# Altium schematic sheet 2_PowerRails.SchDoc: Power Conversion + Rails
size C; Author: Praveen Perera; DrawnBy: Praveen Perera; Engineer: Praveen Perera; Revision: 1; SheetNumber: 2; SheetTotal: 9; Time: 12/22/2025
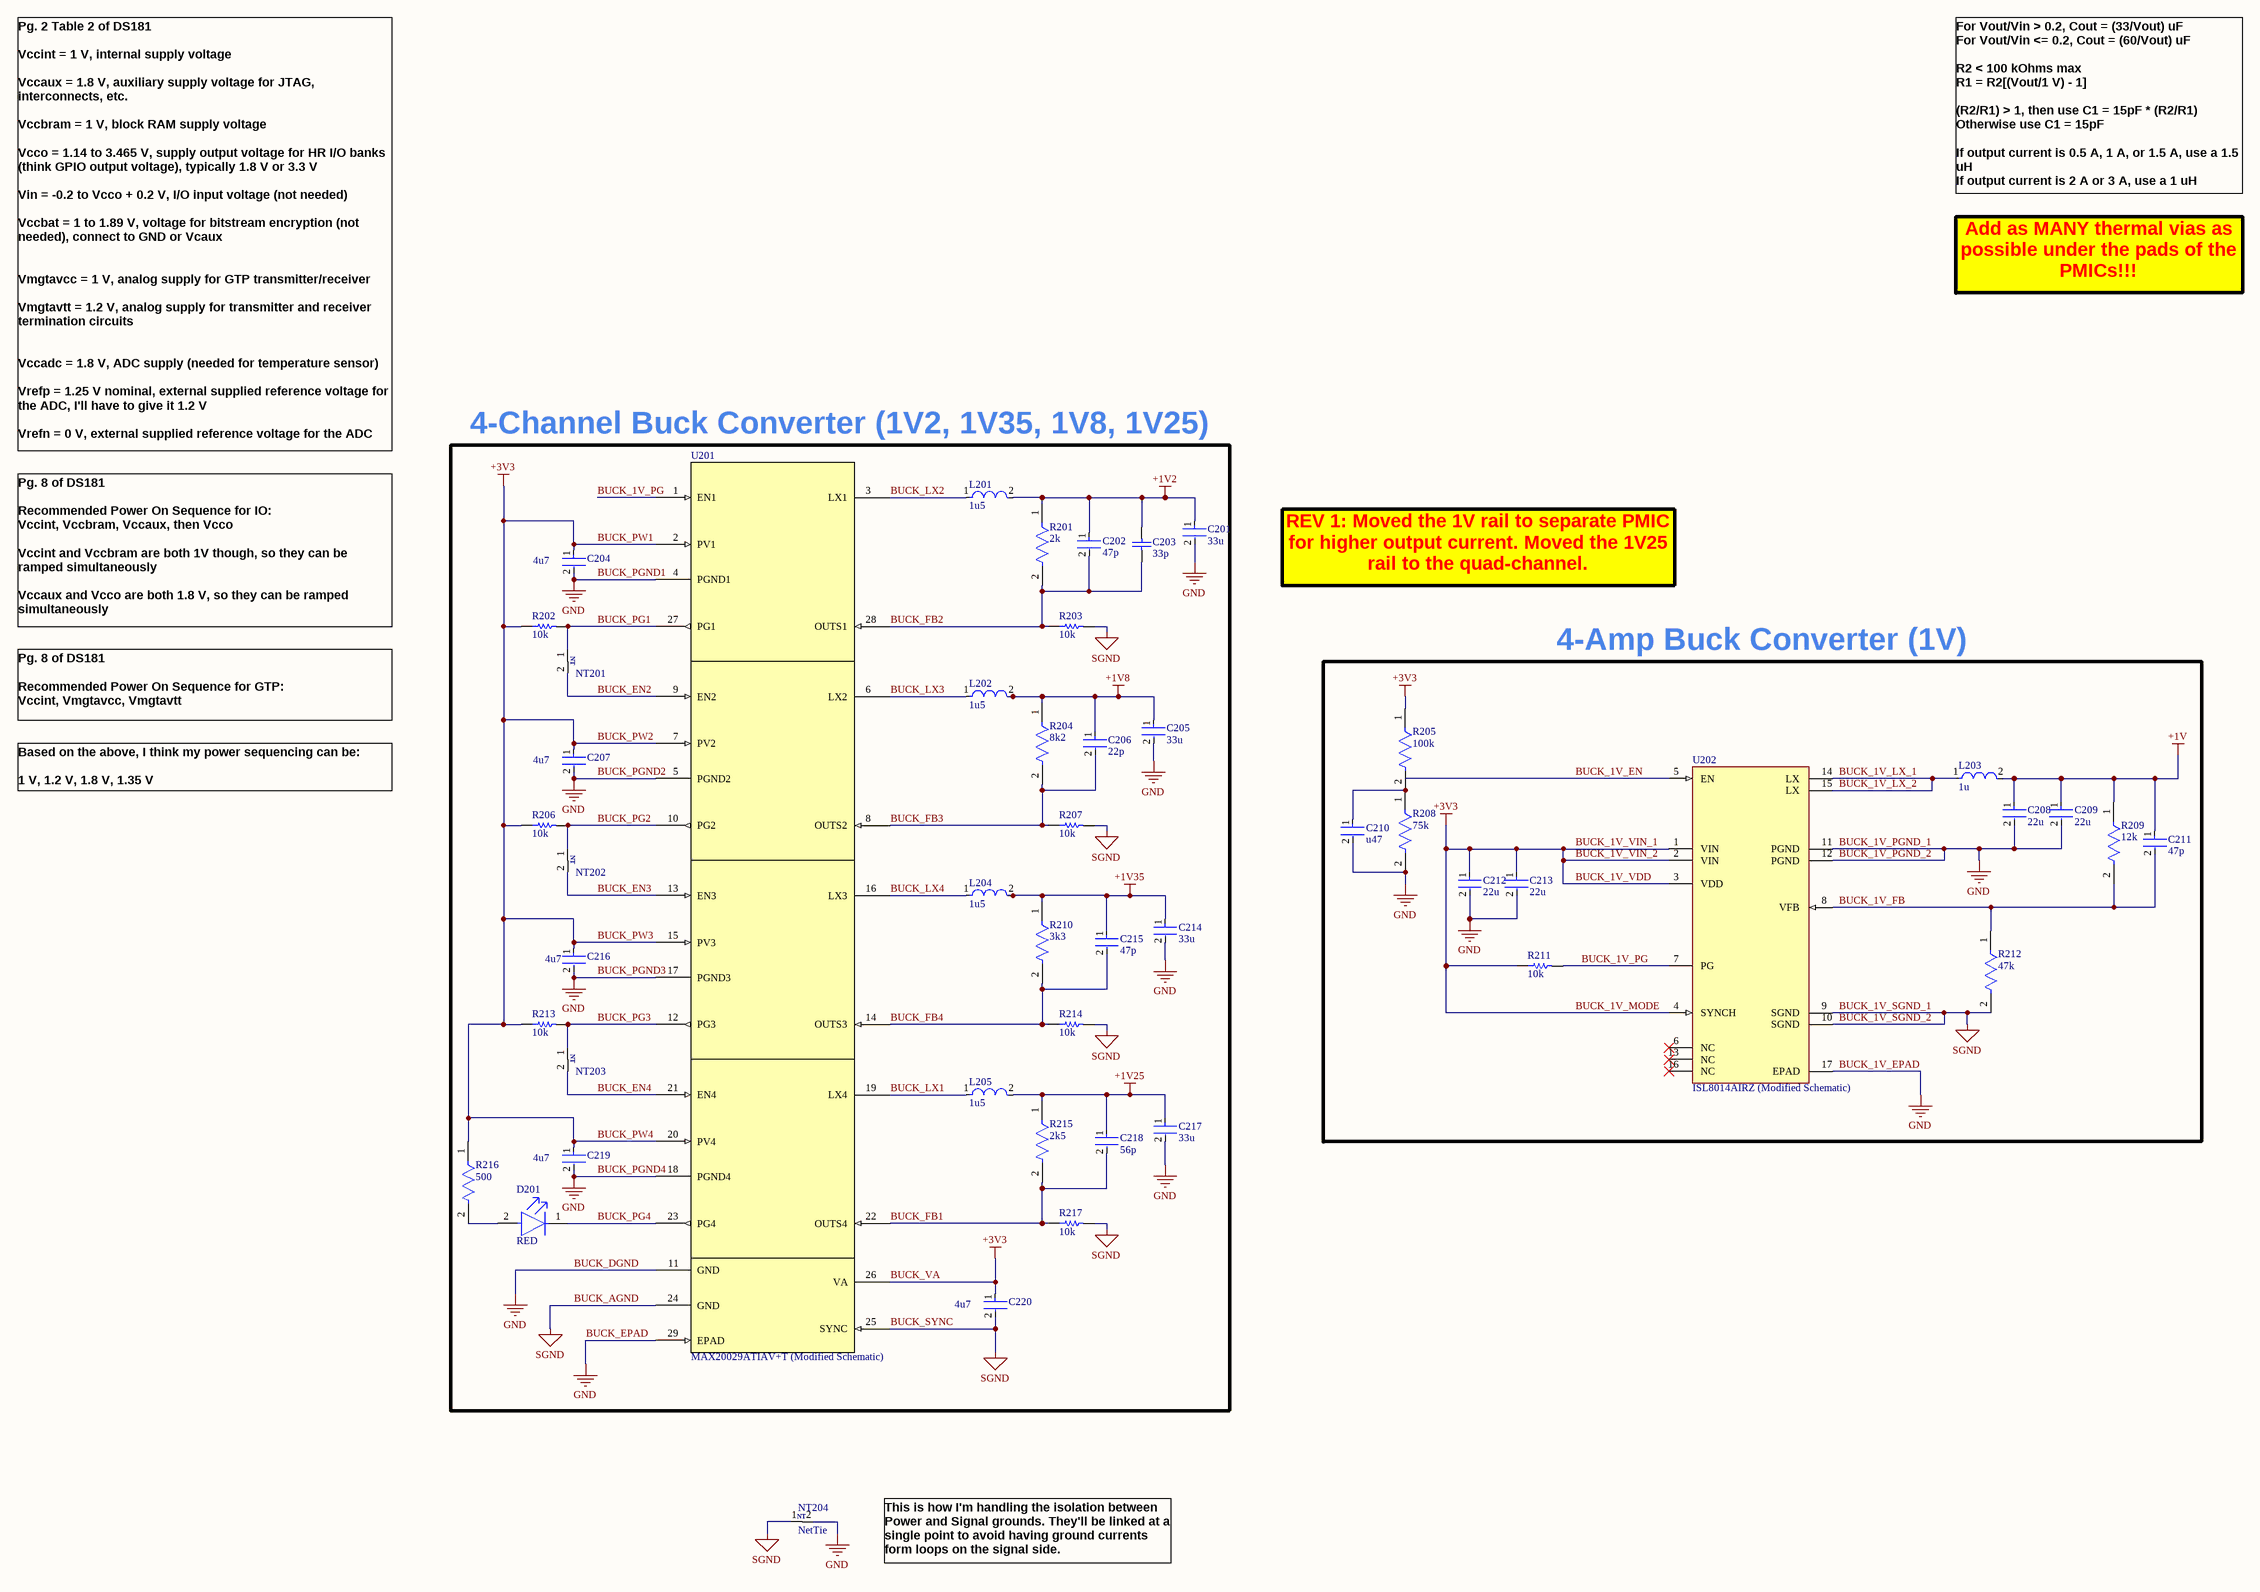
[diagram p0: 2_PowerRails.SchDoc]

## Parts
C201  33u  [FP-C2012-125-0_2-IPC_A]
C202  47p  [FP-GCQ155-0_05-MFG]
C203  33p  [CAPC1005X60X26NL10T16]
C204  4u7  [FP-GCM31C-0_2-e0_3_0_8-IPC_C]
C205  33u  [FP-C2012-125-0_2-IPC_A]
C206  22p  [FP-GJM155-0_05-IPC_A]
C207  4u7  [FP-GCM31C-0_2-e0_3_0_8-IPC_C]
C208  22u  [FP-GRM188-0_2-IPC_A]
C209  22u  [FP-GRM188-0_2-IPC_A]
C210  u47  [FP-C0603-030-0_03-IPC_A]
C211  47p  [FP-GCQ155-0_05-MFG]
C212  22u  [FP-GRM188-0_2-IPC_A]
C213  22u  [FP-GRM188-0_2-IPC_A]
C214  33u  [FP-C2012-125-0_2-IPC_A]
C215  47p  [FP-GCQ155-0_05-MFG]
C216  4u7  [FP-GCM31C-0_2-e0_3_0_8-IPC_C]
C217  33u  [FP-C2012-125-0_2-IPC_A]
C218  56p  [FP-C0402-BB-MFG]
C219  4u7  [FP-GCM31C-0_2-e0_3_0_8-IPC_C]
C220  4u7  [FP-GCM31C-0_2-e0_3_0_8-IPC_C]
D201  RED  [FP-SML-LX0603SIW-TR-MFG]
L201  1u5  [FP-IHLP-2525CZ-FP_2_413x3-MFG]
L202  1u5  [FP-IHLP-2525CZ-FP_2_413x3-MFG]
L203  1u  [FP-IHLP-2525CZ-FP_2_413x3-MFG]
L204  1u5  [FP-IHLP-2525CZ-FP_2_413x3-MFG]
L205  1u5  [FP-IHLP-2525CZ-FP_2_413x3-MFG]
NT201  NetTie  [NETTIE]  (value not drawn)  (net tie, no BOM)
NT202  NetTie  [NETTIE]  (value not drawn)  (net tie, no BOM)
NT203  NetTie  [NETTIE]  (value not drawn)  (net tie, no BOM)
NT204  NetTie  [NETTIE]  (net tie, no BOM)
R201  2k  [FP-MCS0402-IPC_A]
R202  10k  [RESC1005X40X25LL10T10]
R203  10k  [RESC1005X40X25LL10T10]
R204  8k2  [FP-ERA2A-MFG]
R205  100k  [FP-MCS0402-MFG]
R206  10k  [RESC1005X40X25LL10T10]
R207  10k  [RESC1005X40X25LL10T10]
R208  75k  [FP-CR0402-IPC_C]
R209  12k  [FP-RT0402-MFG]
R210  3k3  [FP-ERA2A-MFG]
R211  10k  [RESC1005X40X25LL10T10]
R212  47k  [FP-ERA2A-MFG]
R213  10k  [RESC1005X40X25LL10T10]
R214  10k  [RESC1005X40X25LL10T10]
R215  2k5  [FP-MCT0603-MFG]
R216  500  [FP-PNM0402-MFG]
R217  10k  [RESC1005X40X25LL10T10]
U201  MAX20029ATIAV+T (Modified Schematic)  [21-0140L_T2855-5_MXM]
U202  ISL8014AIRZ (Modified Schematic)  [QFN65P400X400X100-17_L16_4x4_M]

## Nets
+1V: C208.1 C209.1 C211.1 L203.2 R209.1
+1V2: C201.1 C202.1 C203.2 L201.2 R201.1
+1V8: C205.1 C206.1 L202.2 R204.1
+1V25: C217.1 C218.1 L205.2 R215.1
+1V35: C214.1 C215.1 L204.2 R210.1
BUCK_1V_EPAD: C201.2 C204.2 C205.2 C207.2 C208.2 C209.2 C210.2 C212.2 C213.2 C214.2 C216.2 C217.2 C219.2 NT204.2 R208.2 U201.4(PGND1) U201.5(PGND2) U201.11(GND) U201.17(PGND3) U201.18(PGND4) U201.29(EPAD) U202.11(PGND) U202.12(PGND) U202.17(EPAD)  [also labelled BUCK_1V_PGND_1, BUCK_1V_PGND_2, BUCK_DGND, BUCK_EPAD, BUCK_PGND1, BUCK_PGND2, BUCK_PGND3, BUCK_PGND4, GND]
BUCK_1V_MODE: C204.1 C207.1 C212.1 C213.1 C216.1 C219.1 C220.1 R202.1 R205.1 R206.1 R211.1 R213.1 R216.1 U201.2(PV1) U201.7(PV2) U201.15(PV3) U201.20(PV4) U201.26(VA) U202.1(VIN) U202.2(VIN) U202.3(VDD) U202.4(SYNCH)  [also labelled +3V3, BUCK_1V_VDD, BUCK_1V_VIN_1, BUCK_1V_VIN_2, BUCK_PW1, BUCK_PW2, BUCK_PW3, BUCK_PW4, BUCK_VA]
BUCK_1V_SGND_1: C220.2 NT204.1 R203.2 R207.2 R212.2 R214.2 R217.2 U201.24(GND) U201.25(SYNC) U202.9(SGND) U202.10(SGND)  [also labelled BUCK_1V_SGND_2, BUCK_AGND, BUCK_SYNC, SGND]
BUCK_1V_EN: U202.5(EN)
BUCK_1V_FB: C211.2 R209.2 R212.1 U202.8(VFB)
BUCK_1V_LX_1: L203.1 U202.14(LX) U202.15(LX)  [also labelled BUCK_1V_LX_2]
BUCK_1V_PG: R211.2 U201.1(EN1) U202.7(PG)
BUCK_EN2: NT201.2 U201.9(EN2)
BUCK_EN3: NT202.2 U201.13(EN3)
BUCK_EN4: NT203.2 U201.21(EN4)
BUCK_FB1: C218.2 R215.2 R217.1 U201.22(OUTS4)
BUCK_FB2: C202.2 C203.1 R201.2 R203.1 U201.28(OUTS1)
BUCK_FB3: C206.2 R204.2 R207.1 U201.8(OUTS2)
BUCK_FB4: C215.2 R210.2 R214.1 U201.14(OUTS3)
BUCK_LX1: L205.1 U201.19(LX4)
BUCK_LX2: L201.1 U201.3(LX1)
BUCK_LX3: L202.1 U201.6(LX2)
BUCK_LX4: L204.1 U201.16(LX3)
BUCK_PG1: NT201.1 R202.2 U201.27(PG1)
BUCK_PG2: NT202.1 R206.2 U201.10(PG2)
BUCK_PG3: NT203.1 R213.2 U201.12(PG3)
BUCK_PG4: D201.1(C) U201.23(PG4)
NetC210_1: C210.1 R205.2 R208.1
NetD201_2: D201.2(A) R216.2

Not connected (* = marked no-connect by the designer): U202 6(NC)* 13(NC)* 16(NC)*

## Notes on the sheet
- For Vout/Vin > 0.2, Cout = (33/Vout) uF
  For Vout/Vin <= 0.2, Cout = (60/Vout) uF
  R2 < 100 kOhms max
  R1 = R2[(Vout/1 V) - 1]
  (R2/R1) > 1, then use C1 = 15pF * (R2/R1)
  Otherwise use C1 = 15pF
  If output current is 0.5 A, 1 A, or 1.5 A, use a 1.5 uH
  If output current is 2 A or 3 A, use a 1 uH
  If output voltage is less than 0.9 V, use a 0.47 uH
- Add as MANY thermal vias as possible under the pads of the PMICs!!!
- Pg. 2 Table 2 of DS181
  Vccint = 1 V, internal supply voltage
  Vccaux = 1.8 V, auxiliary supply voltage for JTAG, interconnects, etc.
  Vccbram = 1 V, block RAM supply voltage
  Vcco = 1.14 to 3.465 V, supply output voltage for HR I/O banks (think GPIO output voltage), typically 1.8 V or 3.3 V
  Vin = -0.2 to Vcco + 0.2 V, I/O input voltage (not needed)
  Vccbat = 1 to 1.89 V, voltage for bitstream encryption (not needed), connect to GND or Vcaux
  Vmgtavcc = 1 V, analog supply for GTP transmitter/receiver
  Vmgtavtt = 1.2 V, analog supply for transmitter and receiver termination circuits
  Vccadc = 1.8 V, ADC supply (needed for temperature sensor)
  Vrefp = 1.25 V nominal, external supplied reference voltage for the ADC, I'll have to give it 1.2 V
  Vrefn = 0 V, external supplied reference voltage for the ADC
- 4-Channel Buck Converter (1V2, 1V35, 1V8, 1V25)
- Pg. 8 of DS181
  Recommended Power On Sequence for IO:
  Vccint, Vccbram, Vccaux, then Vcco
  Vccint and Vccbram are both 1V though, so they can be ramped simultaneously
  Vccaux and Vcco are both 1.8 V, so they can be ramped simultaneously
- REV 1: Moved the 1V rail to separate PMIC for higher output current. Moved the 1V25 rail to the quad-channel.
- 4-Amp Buck Converter (1V)
- Pg. 8 of DS181
  Recommended Power On Sequence for GTP:
  Vccint, Vmgtavcc, Vmgtavtt
- Based on the above, I think my power sequencing can be:
  1 V, 1.2 V, 1.8 V, 1.35 V
- This is how I'm handling the isolation between Power and Signal grounds. They'll be linked at a single point to avoid having ground currents form loops on the signal side.
- (in symbol CMP-047-000007-1) NT

## Library data of the parts
C201 C205 C214 C217 = CMP-08246-002720-1: C2012X5R1A336M125AC / Multilayer Ceramic Capacitors 33μF ±20% 10V X5R SMD 0805; Capacitance: 33uF; Dielectric: X5R; Series: C; Packaging: Tape and Reel; Voltage Rating: 10V; Height: 1.25mm; Tolerance: 20%; Thickness: 0.057inch; Min Operating Temperature: -55°C; Max Operating Temperature: 85°C; Case Code (Imperial): 0805; Voltage Rating (DC): 10V; Case Code (Metric): 2012; Length: 2mm; REACH SVHC: No SVHC; Depth: 1.25mm; Package Quantity: 1; Dielectric Material: Ceramic; Lead Free: Lead Free; Case/Package: 0805; Termination: SMD/SMT; Resistor Type: Ceramic; RoHS Compliant: Yes; Width: 0.049inch; Weight: 0.000194oz; Mount: Surface Mount
C202 C211 C215 = CMP-06035-040611-1: GCQ1555C1H470GB01D / High Q Ceramic Capacitor for Automotive 47pF ±2% 50VDC C0G 0402 Paper T/R
C203 = CMP-2008-01050-1: VJ0402A330JXAAC; Manufacturer: Vitramon; Part Number: VJ0402A330JXAAC
C204 C207 C216 C219 C220 = CMP-06035-020722-1: GCM31CR71E475KA55K / Ceramic Capacitor for Automotive 4.7uF ±10% 25VDC X7R 1206 Embossed T/R; Voltage Rating: 25V; Case Code (Imperial): 1206; Depth: 1.6mm; Length: 3.2mm; Ratings: AEC-Q200; Capacitance: 4.7uF; Height: 1.6mm; Case/Package: 1206; Packaging: Tape and Reel; Radiation Hardening: No; Dielectric: X7R; Case Code (Metric): 3216; Termination: SMD/SMT; Package Quantity: 6000; Max Operating Temperature: 125°C; Voltage Rating (DC): 25V; Thickness: 0.071inch; Width: 0.063inch; Min Operating Temperature: -55°C; Mount: Surface Mount; Tolerance: 10%
C206 = CMP-06035-061679-1: GJM1555C1H220GB01D / Multi-Layer Ceramic Capacitor 22pF C0G  ±2% 0402 Paper T/R; Voltage Rating (DC): 50V; Length: 1mm; Thickness: 500um; Tolerance: 2%; Capacitance: 22pF; RoHS Compliant: Yes; Dielectric: C0G; Width: 500um
C208 C209 C212 C213 = CMP-06035-063651-1: GRM188R61C226ME01D / Multilayer Ceramic Capacitor 22uF 20% 16V X5R 0603 Paper T/R
C210 = CMP-08246-006895-1: C0603X5R1A474M030BC / Multilayer Ceramic Capacitors 470nF ±20% 10V X5R SMD 0201; Package Quantity: 1; Mount: Surface Mount; RoHS Compliant: Yes; Case/Package: 0201; Case Code (Metric): 0603; Max Operating Temperature: 85°C; Series: C; Min Operating Temperature: -55°C; Length: 0.024inch; Dielectric Material: Ceramic; REACH SVHC: No SVHC; Lead Free: Lead Free; Case Code (Imperial): 0201; Width: 0.012inch; Dielectric: X5R; Capacitance: 470nF; Tolerance: 20%; Thickness: 0.013inch; Voltage Rating: 10V; Packaging: Cut Tape; Voltage Rating (DC): 10V
C218 = CMP-03020-005689-1: C0402C560K5HACTU / C0402 56 pF X8R 10.00% 50 V; Manufacturer: Kemet; Material: Ceramic; Voltage Rating: 50 V; Tolerance: 0.1; Capacitance: 56 pF; Value: 56 pF; Temperature Coefficient: 15%; Device Class L1: Passive Components; Description: C0402 56 pF X8R 10.00% 50 V; Device Class L2: Capacitors; Manufacturer Part Number: C0402C560K5HACTU; Package: C0402-BB; ComponentLink2URL: https://content.kemet.com/datasheets/KEM_C1002_X7R_SMD.pdf; Temperature Range Low: -55°C; Category: Cap; RoHS: TRUE; Height: 0.55mm; Temperature: -55°C to +125°C; Temperature Range High: +125°C; Automotive: No; Octopart: https://octopart.com/c0402c560k5hactu-kemet-88724612; Lead Free: Yes; Device Class L3: Ceramic Capacitors; Ipc Land Pattern Name: CAPC10050X50; ComponentLink2Description: Datasheet; Temperature Characteristic: X8R
D201 = CMP-57192-000009-1: SML-LX0603SIW-TR / LED RED DIFFUSED SMD; Test Current: 20mA; Forward Voltage: 2V; Approvals: UL; Dominant Wavelength: 636nm; Viewing Angle: 140°; Lens Color: White; Luminous Intensity: 60mcd; Power Rating: 50mW; Number of LEDs: 1; Color: Red; Forward Current: 20mA; Moisture Sensitivity Level: 2; Case Code (Imperial): 0603; Lead Free: Lead Free; Lens Transparency: Diffused; Case Code (Metric): 1608; Height: 0.6mm; Max Operating Temperature: 85°C; Width: 0.8mm; Lens Style: Diffused; Illumination Color: Red; Wavelength: 636nm; REACH SVHC: No SVHC; Package Quantity: 1; RoHS Compliant: Yes; Case/Package: 0603; Number of Pins: 2; Packaging: Tape and Reel; Length: 1.6mm; Mount: Surface Mount; Min Operating Temperature: -25°C
L201 L202 L204 L205 = CMP-02424-000713-1: IHLP2525CZER1R5M07 / Commercial Inductors, High Saturation Series, 5 % DCR Tolerance 1.5uH 9A 14.5mΩ 20%; DC Resistance (DCR): 14.5mR; Saturation Current: 18A; Test Frequency: 100kHz; Shielding: Shielded; Lead Free: Lead Free; Tolerance: 20%; Radiation Hardening: No; Series: IHLP-2525CZ-07; Width: 0.255inch; Length: 0.27inch; Depth: 6.72mm; Case/Package: Nonstandard; Height: 3mm; Mount: Surface Mount; Package Quantity: 2000; Current Rating: 9A; Height - Seated (Max): 0.118inch; Packaging: Tape and Reel; Inductance: 1.5uH; Max Operating Temperature: 125°C; Min Operating Temperature: -55°C
L203 = CMP-02424-000664-1: IHLP2525CZER1R0M8A / Automotive Inductors, High Temperature (180 °C) Series 1uH 12A 8.45mΩ 20%; Test Frequency: 100kHz; DC Resistance (DCR): 8.45mR; Self Resonant Frequency: 59.1MHz; Saturation Current: 13A; Shielding: Shielded; Inductance Tolerance: 20%; Width: 6.47mm; Min Operating Temperature: -55°C; Height - Seated (Max): 0.118inch; Ratings: AEC-Q200; Max Operating Temperature: 180°C; RMS Current (Irms): 12A; Package Quantity: 2000; Mount: Surface Mount; Height: 3mm; Termination: SMD/SMT; Case/Package: Nonstandard; Packaging: Tape and Reel; Tolerance: 20%; Current Rating: 12A; Inductance: 1uH; Max DC Current: 12A; Length: 0.27inch
NT201-NT204 = CMP-047-000007-1: Net Tie; Source: Schematic-Lib-PhilsLab.SchLib; Design Item ID: NetTie
R201 = CMP-02407-003721-1: MCS0402MD2001BE100 / RES SMD 1.2K OHM 1% 1/10W 0402; Resistance: 2kR; Temperature Coefficient: 25ppm/°C; Power Rating: 63mW; Voltage Rating: 50V; Tolerance: 0.1%; Lead Free: Lead Free; Max Operating Temperature: 155°C; Case/Package: 0402; Case Code (Metric): 1005; Height: 0.32mm; Composition: Thin Film; Weight: 2.1E-05oz; Width: 0.5mm; Case Code (Imperial): 0402; Packaging: Tape and Reel; Length: 1mm; Min Operating Temperature: -55°C; Contact Plating: Tin
R202 R203 R206 R207 R211 R213 R214 R217 = CMP-2002-04584-1: SG73P1ETTP1002F; Manufacturer: KOA Speer; Part Number: SG73P1ETTP1002F
R204 = CMP-2002-05828-2: ERA-2AEB822X / RES SMD 8.2K OHM 0.1% 1/16W 0402; Manufacturer: Panasonic Electronic Components; Value: 8.2kΩ; Temperature Coefficient: 25ppm/°C; Voltage Rating: 50V; Automotive Grade: Grade 0; Power Rating: 0.063W; Temperature Range Low: -55°C; Lead Free: Yes; Device Class L2: Resistors; Height: 0.4mm; RoHS: TRUE; Mouser Description: Thin Film Resistors - SMD 0402 1/16W 8.2Kohms; Octopart: https://octopart.com/era-2aeb822x-panasonic-43284358; Tolerance: 0.1%; Composition: Thin Film; Package: ERA2A; Resistance: 8.2kΩ; Temperature: -55°C to +155°C; Series: ERA; Manufacturer Part Number: ERA-2AEB822X; ComponentLink2URL: https://industrial.panasonic.com/cdbs/www-data/pdf/RDM0000/AOA0000C307.pdf; Digikey Description: RES SMD 8.2K OHM 0.1% 1/16W 0402; ComponentLink2Description: Datasheet; Category: Res; Footprint Url: https://industrial.panasonic.com/cdbs/www-data/pdf/RDM0000/DMM0000COL17.pdf; Temperature Range High: +155°C; Automotive: Yes; Device Class L1: Passive Components; Device Class L3: Chip SMD Resistors
R205 = CMP-02407-000800-1: MCS04020D1003BE000 / RES SMD 1.2K OHM 1% 1/10W 0402; Temperature Coefficient: 25ppm/°C; Resistance: 100kR; Tolerance: 0.1%; Min Operating Temperature: -55°C; Lead Free: Lead Free; Contact Plating: Tin; Radiation Hardening: No; Max Operating Temperature: 125°C; Composition: Thin Film; Case/Package: 0402
R208 = CMP-2002-05392-2: CR0402-FX-7502GLF / Thick Film Chip Resistors 0402 75kΩ 0.0625W 1% 100ppm/°C; Max Power Dissipation: 63mW; Voltage Rating: 50V; Power Rating: 62.5mW; Resistance: 75kR; Min Operating Temperature: -55°C; Max Operating Temperature: 125°C; Mount: Surface Mount; Radiation Hardening: No; Depth: 0.5mm; Case Code (Imperial): 0402; Length: 1mm; Number of Terminations: 2; Case Code (Metric): 1005; Case/Package: 0402; Package Quantity: 10000; Temperature Coefficient: 100ppm/°C; Contact Plating: Tin; Composition: Thick Film; Thickness: 356um; Termination: SMD/SMT; Tolerance: 1%; Packaging: Tape and Reel; Width: 0.5mm; Height: 0.016inch; Military Standard: Not
R209 = CMP-03412-001954-1: RT0402DRE0712KL / RES SMD 12K OHM 0.5% 1/16W 0402; Manufacturer: Yageo; Power Rating: 0.063W; Description: RT0402 12KΩ 0.063W 50 ppm/°C 0.50%; Tolerance: 0.005; Temperature Coefficient: 50 ppm/°C; Voltage Rating: 50V; Value: 12KΩ; Series: RT; Octopart: https://octopart.com/rt0402dre0712kl-yageo-1393491; Category: Res; Mouser Description: Thin Film Resistors 1/16W 12K ohm .5% 50ppm; Manufacturer Part Number: RT0402DRE0712KL; Device Class L1: Passive Components; Height: 0.35mm; Temperature: -55°C to +155°C; ComponentLink2Description: Datasheet; Temperature Range High: +155°C; Device Class L3: Chip SMD Resistors; Device Class L2: Resistors; Lead Free: Yes; Footprint Url: http://www.yageo.com/exep/pages/download/literatures/PYu-R_Mount_10.pdf; Ipc Land Pattern Name: RESC10050X30; RoHS: TRUE; Package: RT0402; Composition: Thin Film; Digikey Description: RES SMD 12K OHM 0.5% 1/16W 0402; Automotive: No; ComponentLink2URL: http://www.yageo.com/documents/recent/PYu-RT_1-to-0.01_RoHS_L_9.pdf; Temperature Range Low: -55°C; Resistance: 12KΩ
R210 = CMP-2002-05884-2: ERA-2AEB332X; NexarPartId: 9251384; Voltage Rating (DC): 25V; Temperature Coefficient: 25ppm/°C; Tolerance: 0.1%; Resistance: 3.3kΩ; Power Rating: 63mW; Case/Package: 0402; Number of Terminations: 2; Military Standard: Not; Case Code (Imperial): 0402; Length: 1mm; Contact Plating: Tin; Termination: SMD/SMT; Schedule B: 8533210045, 8533210045; Voltage Rating: 25V; Lead Free: Lead Free; Min Operating Temperature: -55°C; REACH SVHC: No SVHC; Max Power Dissipation: 63mW; Weight: 793.786648µg; RoHS: Compliant; Depth: 500µm; Packaging: Cut Tape; Max Operating Temperature: 155°C; Width: 500µm; Case Code (Metric): 1005; Height: 350µm; Composition: Thin Film; Lifecycle Status: Production; Radiation Hardening: No; Number of Pins: 2; Mount: Surface Mount
R212 = CMP-2002-05889-2: ERA-2AEB473X; NexarPartId: 9251373; Voltage Rating: 25V; Tolerance: 0.1%; Resistance: 47kΩ; Power Rating: 63mW; Temperature Coefficient: 25ppm/°C; Radiation Hardening: No; Case Code (Imperial): 0402; Depth: 500µm; Military Standard: Not; Number of Pins: 2; Number of Terminations: 2; Length: 1mm; RoHS: Compliant; Case Code (Metric): 1005; Schedule B: 8533210045, 8533210045; Composition: Thin Film; REACH SVHC: Unknown; Lifecycle Status: Production; Case/Package: 0402; Mount: Surface Mount; Packaging: Tape & Reel; Contact Plating: Tin; Lead Free: Lead Free; Max Power Dissipation: 63mW; Voltage Rating (DC): 25V; Height: 350µm; Width: 508µm; Min Operating Temperature: -55°C; Max Operating Temperature: 155°C
R215 = CMP-02407-001734-1: MCT06030E2501BP100 / RES SMD 100 OHM 1% 1/8W 0603; Tolerance: 0.1%; Resistance: 2.5kR; Temperature Coefficient: 15ppm/°C; Length: 1.55mm; Max Operating Temperature: 125°C; Composition: Thin Film; Radiation Hardening: No; Lead Free: Lead Free; Military Standard: Not; Packaging: Tape and Reel; Depth: 0.85mm; Contact Plating: Tin; Width: 850um; Case/Package: 0603; Min Operating Temperature: -55°C
R216 = CMP-02407-011888-1: PNM0402E5000BST1 / RES SMD 500 OHM 0.1% 1/20W 0402; Temperature Coefficient: 25ppm/°C; Max Power Dissipation: 50mW; Resistance: 500R; Width: 0.022inch; Length: 0.042inch; Tolerance: 0.1%; Lead Free: Lead Free; Height: 0.033inch; Case Code (Metric): 1005; Features: Moisture Resistant; Case Code (Imperial): 0402; Max Operating Temperature: 155°C; Case/Package: 0402; Min Operating Temperature: -55°C; Package Quantity: 1000; RoHS Compliant: Yes; Packaging: Tape and Reel; Resistor Type: Thin Film; Number of Terminations: 2
U201 = CMP-010-000006-2: Automotive Quad/Triple Low-Voltage Step-Down DC-DC Converters; Manufacturer_Name: Analog Devices / Maxim Integrated; Manufacturer_Part_Number: MAX20029ATIA/V+T; Source: MAX20029ATIAV&plus_T - Modified.SchLib; RefDes: RefDes; Design Item ID: MAX20029ATIAV+T; Copyright: Copyright (C) 2025 Ultra Librarian. All rights reserved.; Pin Count: 29; Component Type: Standard; Type: Type
U202 = CMP-002-000041-4: ISL8014 Series 2.8 - 5.5 V 1 MHz 4 A Buck Regulator - QFN-16